# EAGLE schematic EM80RD (EAGLE 7.4.0)
DOC_NUM: DR20000110; REV: 10
Assembly variants: STD

## Sheet 1 of 5
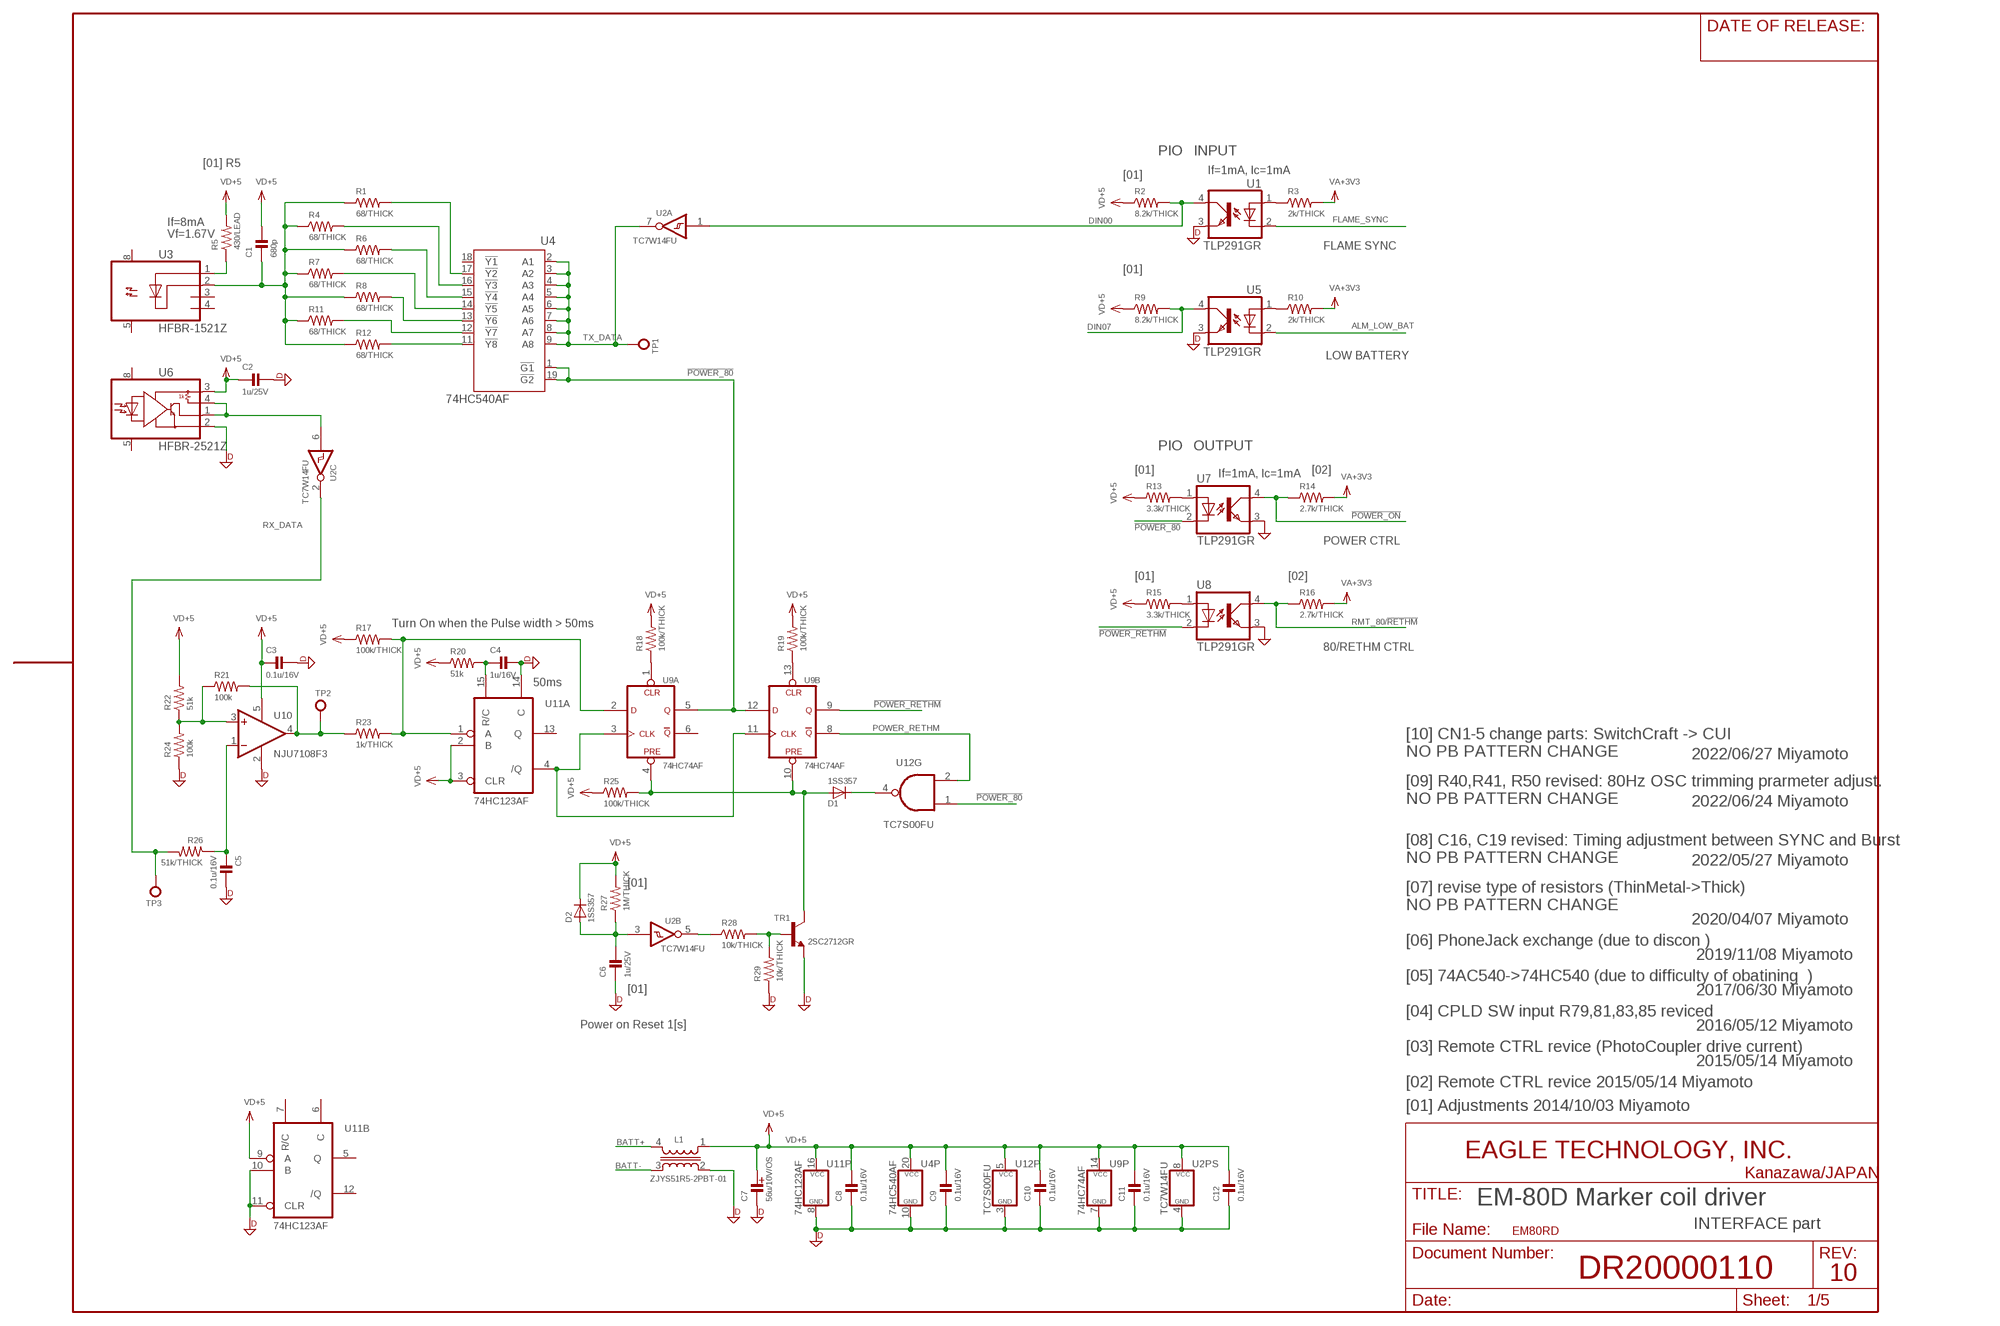
[diagram p0: schematic, sheet 1]

### Parts
C1  680p  CSMD1.6X0.8MM  [CM1608]
C2  1u/25V  CSMD2.0X1.2MM  [CM2012]
C3  0.1u/16V  CSMD1.6X0.8MM  [CM1608]
C4  1u/16V  CSMD2.0X1.2MM  [CM2012]
C5  0.1u/16V  CSMD1.6X0.8MM  [CM1608]
C6  1u/25V  CSMD1.6X0.8MM  [CM1608]
C7  56u/10V/OS  C_POL6.3-2.5MM  [PHI_6.3]
C8  0.1u/16V  CSMD1.6X0.8MM  [CM1608]
C9  0.1u/16V  CSMD1.6X0.8MM  [CM1608]
C10  0.1u/16V  CSMD1.6X0.8MM  [CM1608]
C11  0.1u/16V  CSMD1.6X0.8MM  [CM1608]
C12  0.1u/16V  CSMD1.6X0.8MM  [CM1608]
D1  1SS357  [SOD323-R]
D2  1SS357  [SOD323-R]
L1  ZJYS51R5-2PBT-01  ZJYS5R5-2PBT-01  [ZJYS51-2]
R1  68/THICK  RSMD1.6X0.8MM  [RM1608]
R2  8.2k/THICK  RSMD1.6X0.8MM  [RM1608]
R3  2k/THICK  RSMD1.6X0.8MM  [RM1608]
R4  68/THICK  RSMD1.6X0.8MM  [RM1608]
R5  430/LEAD  R0207/2V  [0207/2V]
R6  68/THICK  RSMD1.6X0.8MM  [RM1608]
R7  68/THICK  RSMD1.6X0.8MM  [RM1608]
R8  68/THICK  RSMD1.6X0.8MM  [RM1608]
R9  8.2k/THICK  RSMD1.6X0.8MM  [RM1608]
R10  2k/THICK  RSMD1.6X0.8MM  [RM1608]
R11  68/THICK  RSMD1.6X0.8MM  [RM1608]
R12  68/THICK  RSMD1.6X0.8MM  [RM1608]
R13  3.3k/THICK  RSMD1.6X0.8MM  [RM1608]
R14  2.7k/THICK  RSMD1.6X0.8MM  [RM1608]
R15  3.3k/THICK  RSMD1.6X0.8MM  [RM1608]
R16  2.7k/THICK  RSMD1.6X0.8MM  [RM1608]
R17  100k/THICK  RSMD1.6X0.8MM  [RM1608]
R18  100k/THICK  RSMD1.6X0.8MM  [RM1608]
R19  100k/THICK  RSMD1.6X0.8MM  [RM1608]
R20  51k  RSMD1.6X0.8MM  [RM1608]
R21  100k  RSMD1.6X0.8MM  [RM1608]
R22  51k  RSMD1.6X0.8MM  [RM1608]
R23  1k/THICK  RSMD1.6X0.8MM  [RM1608]
R24  100k  RSMD1.6X0.8MM  [RM1608]
R25  100k/THICK  RSMD1.6X0.8MM  [RM1608]
R26  51k/THICK  RSMD1.6X0.8MM  [RM1608]
R27  1M/THICK  RSMD1.6X0.8MM  [RM1608]
R28  10k/THICK  RSMD1.6X0.8MM  [RM1608]
R29  10k/THICK  RSMD1.6X0.8MM  [RM1608]
TP1  TP-LC3G  [TP_TH_0R9MM]
TP2  TP-LC3G  [TP_TH_0R9MM]
TP3  TP-LC3G  [TP_TH_0R9MM]
TR1  2SC2712GR  [SOT23-BEC]
U1  TLP291GR  [SO4(11-3C1)(TOSHIBA)]
U2  TC7W14FU  TC7WZ14FU  [SSOP8-P-065]
U3  HFBR-1521Z  [HFBR-X52X]
U4  74HC540AF  [SO20_300MIL]
U5  TLP291GR  [SO4(11-3C1)(TOSHIBA)]
U6  HFBR-2521Z  [HFBR-X52X]
U7  TLP291GR  [SO4(11-3C1)(TOSHIBA)]
U8  TLP291GR  [SO4(11-3C1)(TOSHIBA)]
U9  74HC74AF  [SO14_300MIL]
U10  NJU7108F3  [SC88A]
U11  74HC123AF  [SO16_300MIL]
U12  TC7S00FU  [SSOP5-P-065A(USV)]

### Nets
!POWER_80: U4.1(!G1) U4.19(!G2) U7.2(C) U9.5(A:Q) U9.12(B:D) U12.1(G:I1)
!POWER_ON: R14.1 U7.4(COL) ; also sheet 4
!POWER_RETHM: U8.2(C) U9.9(B:Q)
AGND: U7.3(EMI) U8.3(EMI) ; also sheet 2,3,4
ALM_LOW_BAT: U5.2(C) ; also sheet 4
BATT+: L1.4 ; also sheet 2
BATT-: L1.3 ; also sheet 2
DGND: C2.1 C3.1 C4.1 C5.1 C6.2 C7.NEG C8.2 C9.2 C10.2 C11.2 C12.2 L1.2 R24.1 R29.1 TR1.E U1.3(EMI) U2.4(PS:GND) U4.10(GND) U5.3(EMI) U6.2(GND) U9.7(P:GND) U10.2(V-) U11.8(P:GND) U11.10(B:B) U11.11(B:CLR) U11.14(A:C) U12.3(P:GND) ; also sheet 2,5
DIN00: R2.2 U1.4(COL) U2.1(A:I)
DIN07: R9.2 U5.4(COL)
FLAME_SYNC: U1.2(C) ; also sheet 4
N$1: R1.2 U4.17(!Y2)
N$2: R6.2 U4.15(!Y4)
N$3: R7.2 U4.14(!Y5)
N$4: R8.2 U4.13(!Y6)
N$5: R11.2 U4.12(!Y7)
N$6: R12.2 U4.11(!Y8)
N$7: R4.2 U4.16(!Y3)
N$9: R21.1 R22.1 R24.2 U10.3(+IN)
N$10: R21.2 R23.1 TP2.1(MP) U10.4(OUT)
N$12: C5.2 R26.1 U10.1(-IN)
N$14: D1.A R25.2 TR1.C U9.4(A:PRE) U9.10(B:PRE)
N$15: R19.1 U9.13(B:CLR)
N$16: C1.2 R1.1 R4.1 R6.1 R7.1 R8.1 R11.1 R12.1 U3.2(C)
N$18: R5.1 U3.1(A)
N$20: U2.6(C:I) U6.1(VO) U6.4(RL)
N$23: R3.1 U1.1(A)
N$24: R10.1 U5.1(A)
N$54: U9.3(A:CLK) U9.11(B:CLK) U11.4(A:/Q)
N$99: C6.1 D2.A R27.1 U2.3(B:I)
N$101: R13.2 U7.1(A)
N$104: R15.2 U8.1(A)
N$125: R18.1 U9.1(A:CLR)
N$126: C4.2 R20.2 U11.15(A:R/C)
N$128: D1.C U12.4(G:O)
N$129: R28.1 U2.5(B:O)
N$130: R28.2 R29.2 TR1.B
POWER_RETHM: U9.8(B:!Q) U12.2(G:I0)
PWR_ON: R17.2 R23.2 U9.2(A:D) U11.1(A:A)
RMT_80/!RETHM: R16.1 U8.4(COL) ; also sheet 4
RX_DATA: R26.2 TP3.1(MP) U2.2(C:O)
TX_DATA: TP1.1(MP) U2.7(A:O) U4.2(A1) U4.3(A2) U4.4(A3) U4.5(A4) U4.6(A5) U4.7(A6) U4.8(A7) U4.9(A8)
VA+3V3: R3.2 R10.2 R14.2 R16.2 ; also sheet 2,4
VD+5: C1.1 C2.2 C3.2 C7.POS C8.1 C9.1 C10.1 C11.1 C12.1 D2.C L1.1 R2.1 R5.2 R9.1 R13.1 R15.1 R17.1 R18.2 R19.2 R20.1 R22.2 R25.1 R27.2 U2.8(PS:VCC) U4.20(VCC) U6.3(VCC) U9.14(P:VCC) U10.5(V+) U11.2(A:B) U11.3(A:CLR) U11.9(B:A) U11.16(P:VCC) U12.5(P:VCC)
Unconnected: U3.3(NC1) U3.4(NC2) U3.5(TAB2) U3.8(TAB1) U4.18(!Y1) U6.5(TAB2) U6.8(TAB1) U9.6(A:!Q) U11.5(B:Q) U11.6(B:C) U11.7(B:R/C) U11.12(B:/Q) U11.13(A:Q)

### Notes on the sheet
- PIO | INPUT
- [01] R5
- If=1mA, Ic=1mA
- [01]
- If=8mA
- Vf=1.67V
- FLAME SYNC
- [01]
- LOW BATTERY
- PIO | OUTPUT
- [01] | [02]
- If=1mA, Ic=1mA
- POWER CTRL
- [01] | [02]
- Turn On when the Pulse width > 50ms
- 80/RETHM CTRL
- 50ms
- [10] CN1-5 change parts: SwitchCraft -> CUI 
  NO PB PATTERN CHANGE
- 2022/06/27 Miyamoto
- [09] R40,R41, R50 revised: 80Hz OSC trimming prarmeter adjust. 
  NO PB PATTERN CHANGE
- 2022/06/24 Miyamoto
- [08] C16, C19 revised: Timing adjustment between SYNC and Burst
  NO PB PATTERN CHANGE
- 2022/05/27 Miyamoto
- [01]
- [07] revise type of resistors (ThinMetal->Thick)
  NO PB PATTERN CHANGE
- 2020/04/07 Miyamoto
- [06] PhoneJack exchange (due to discon )
- 2019/11/08 Miyamoto
- [05] 74AC540->74HC540 (due to difficulty of obatining  )
- [01] | 2017/06/30 Miyamoto
- [04] CPLD SW input R79,81,83,85 reviced
- Power on Reset 1[s] | 2016/05/12 Miyamoto
- [03] Remote CTRL revice (PhotoCoupler drive current)
- 2015/05/14 Miyamoto
- [02] Remote CTRL revice 2015/05/14 Miyamoto
- [01] Adjustments 2014/10/03 Miyamoto
- EM-80D Marker coil driver
- INTERFACE part

## Sheet 2 of 5
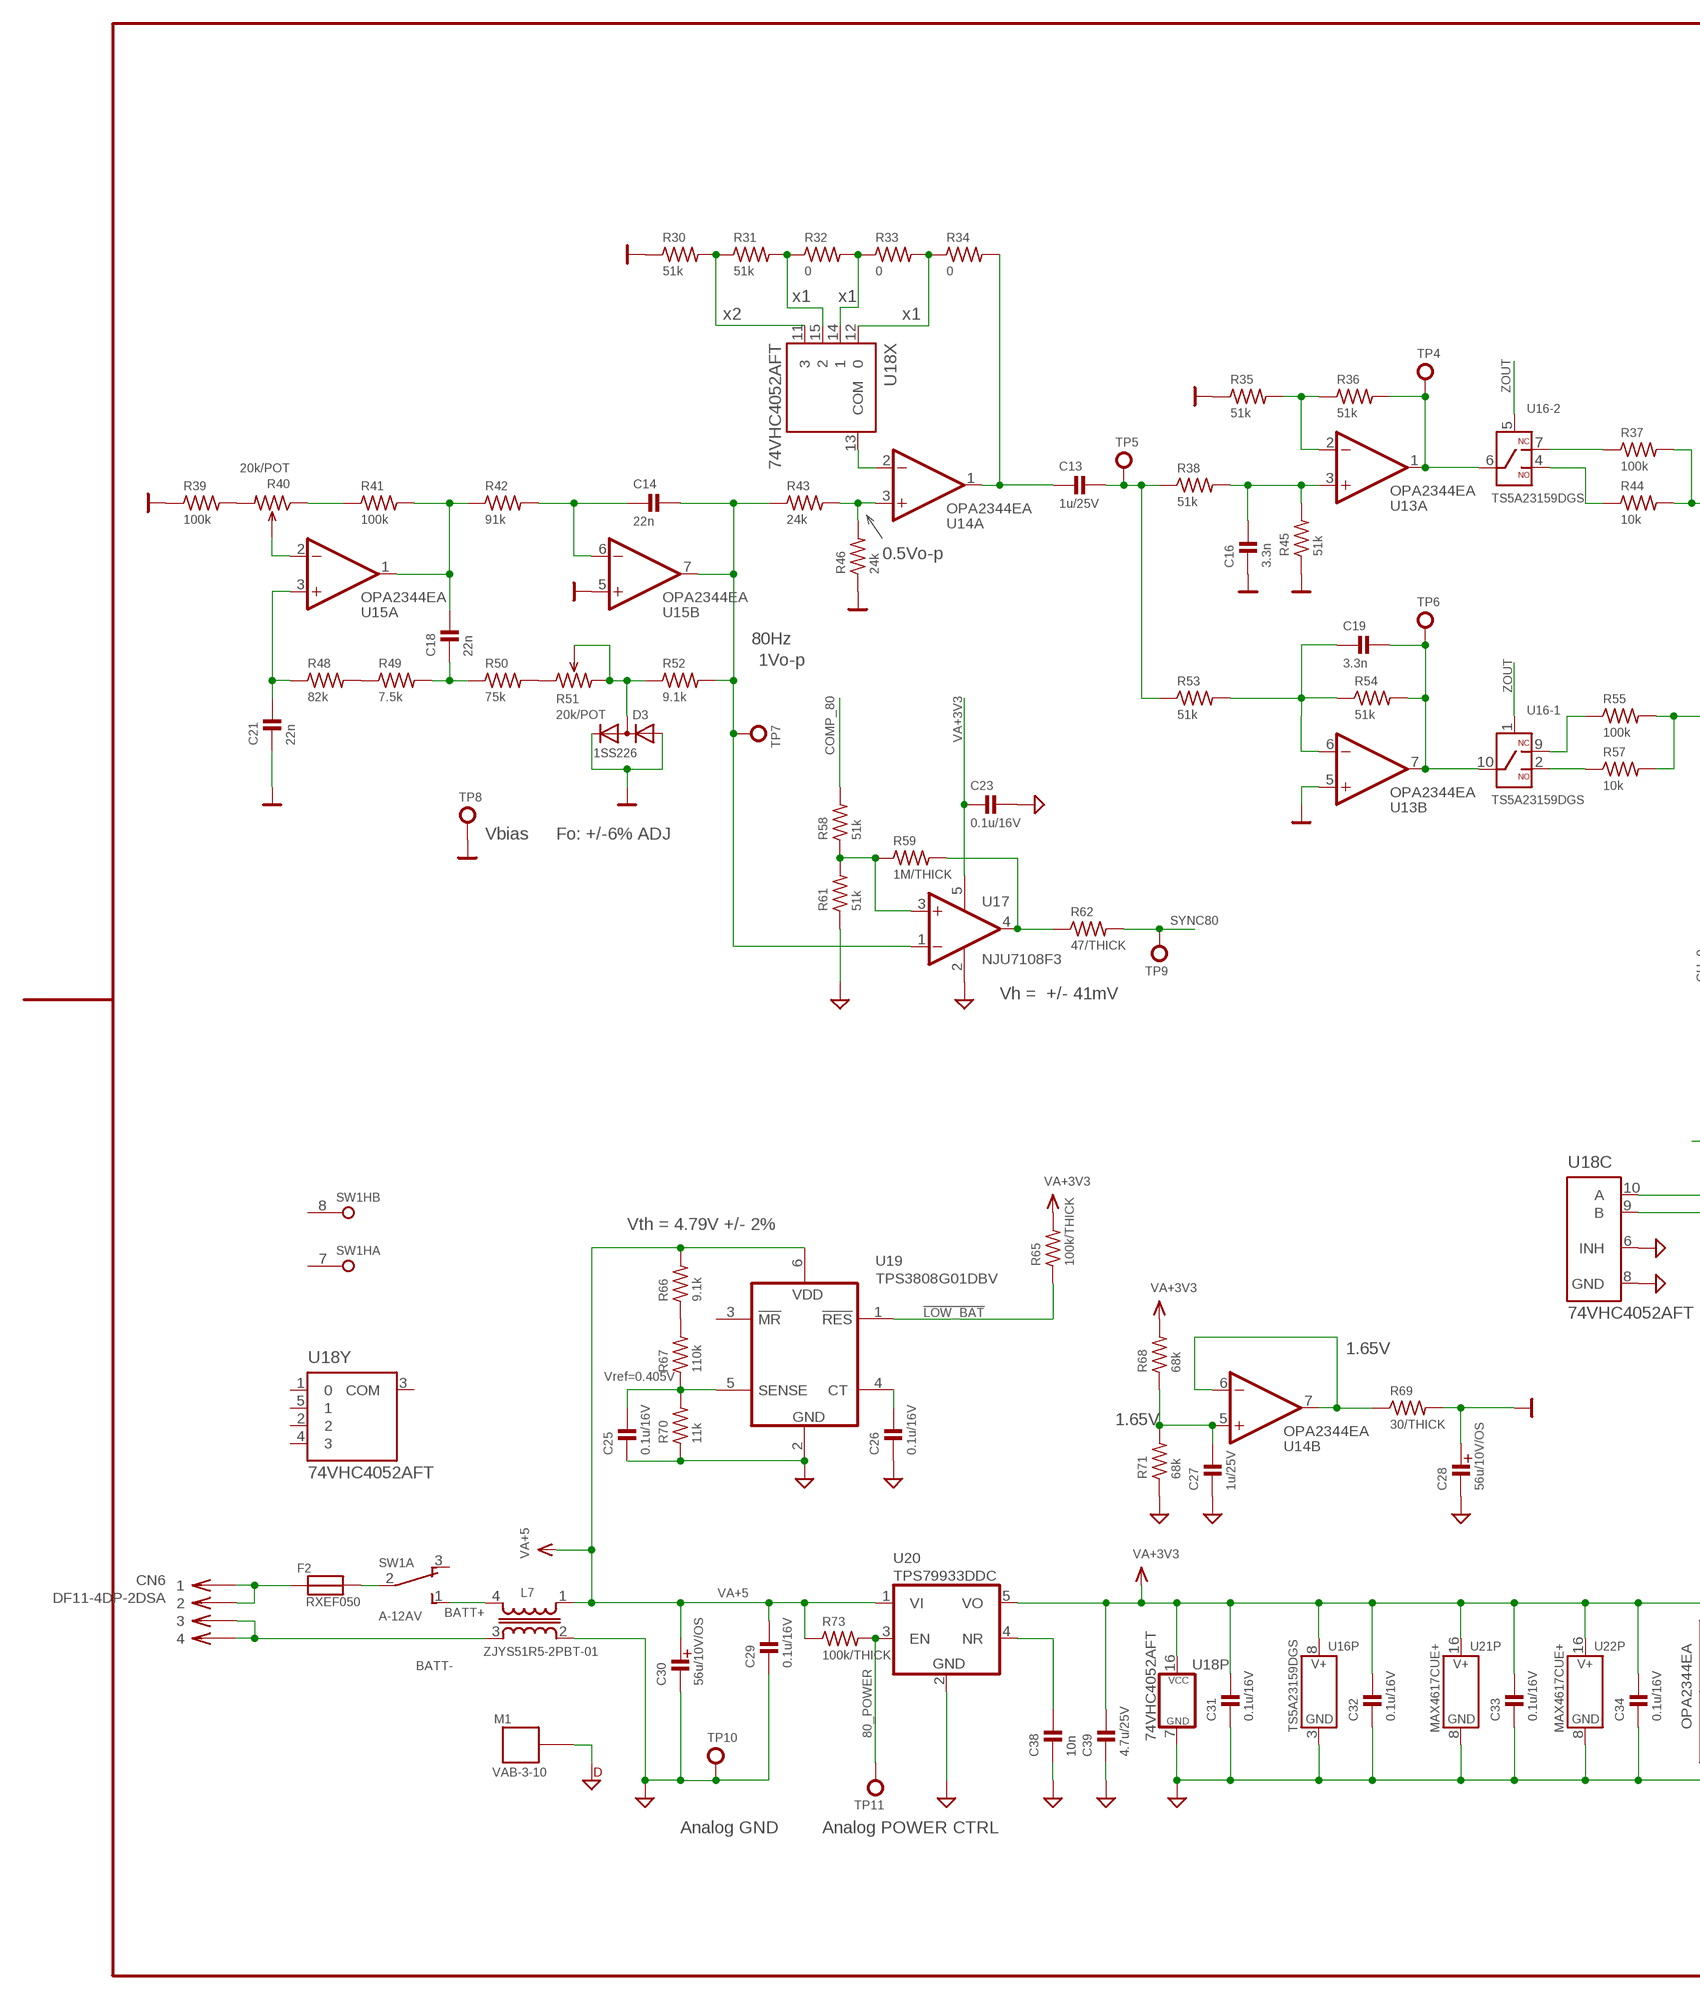
[diagram p1: schematic, sheet 2, part 1 of 2]
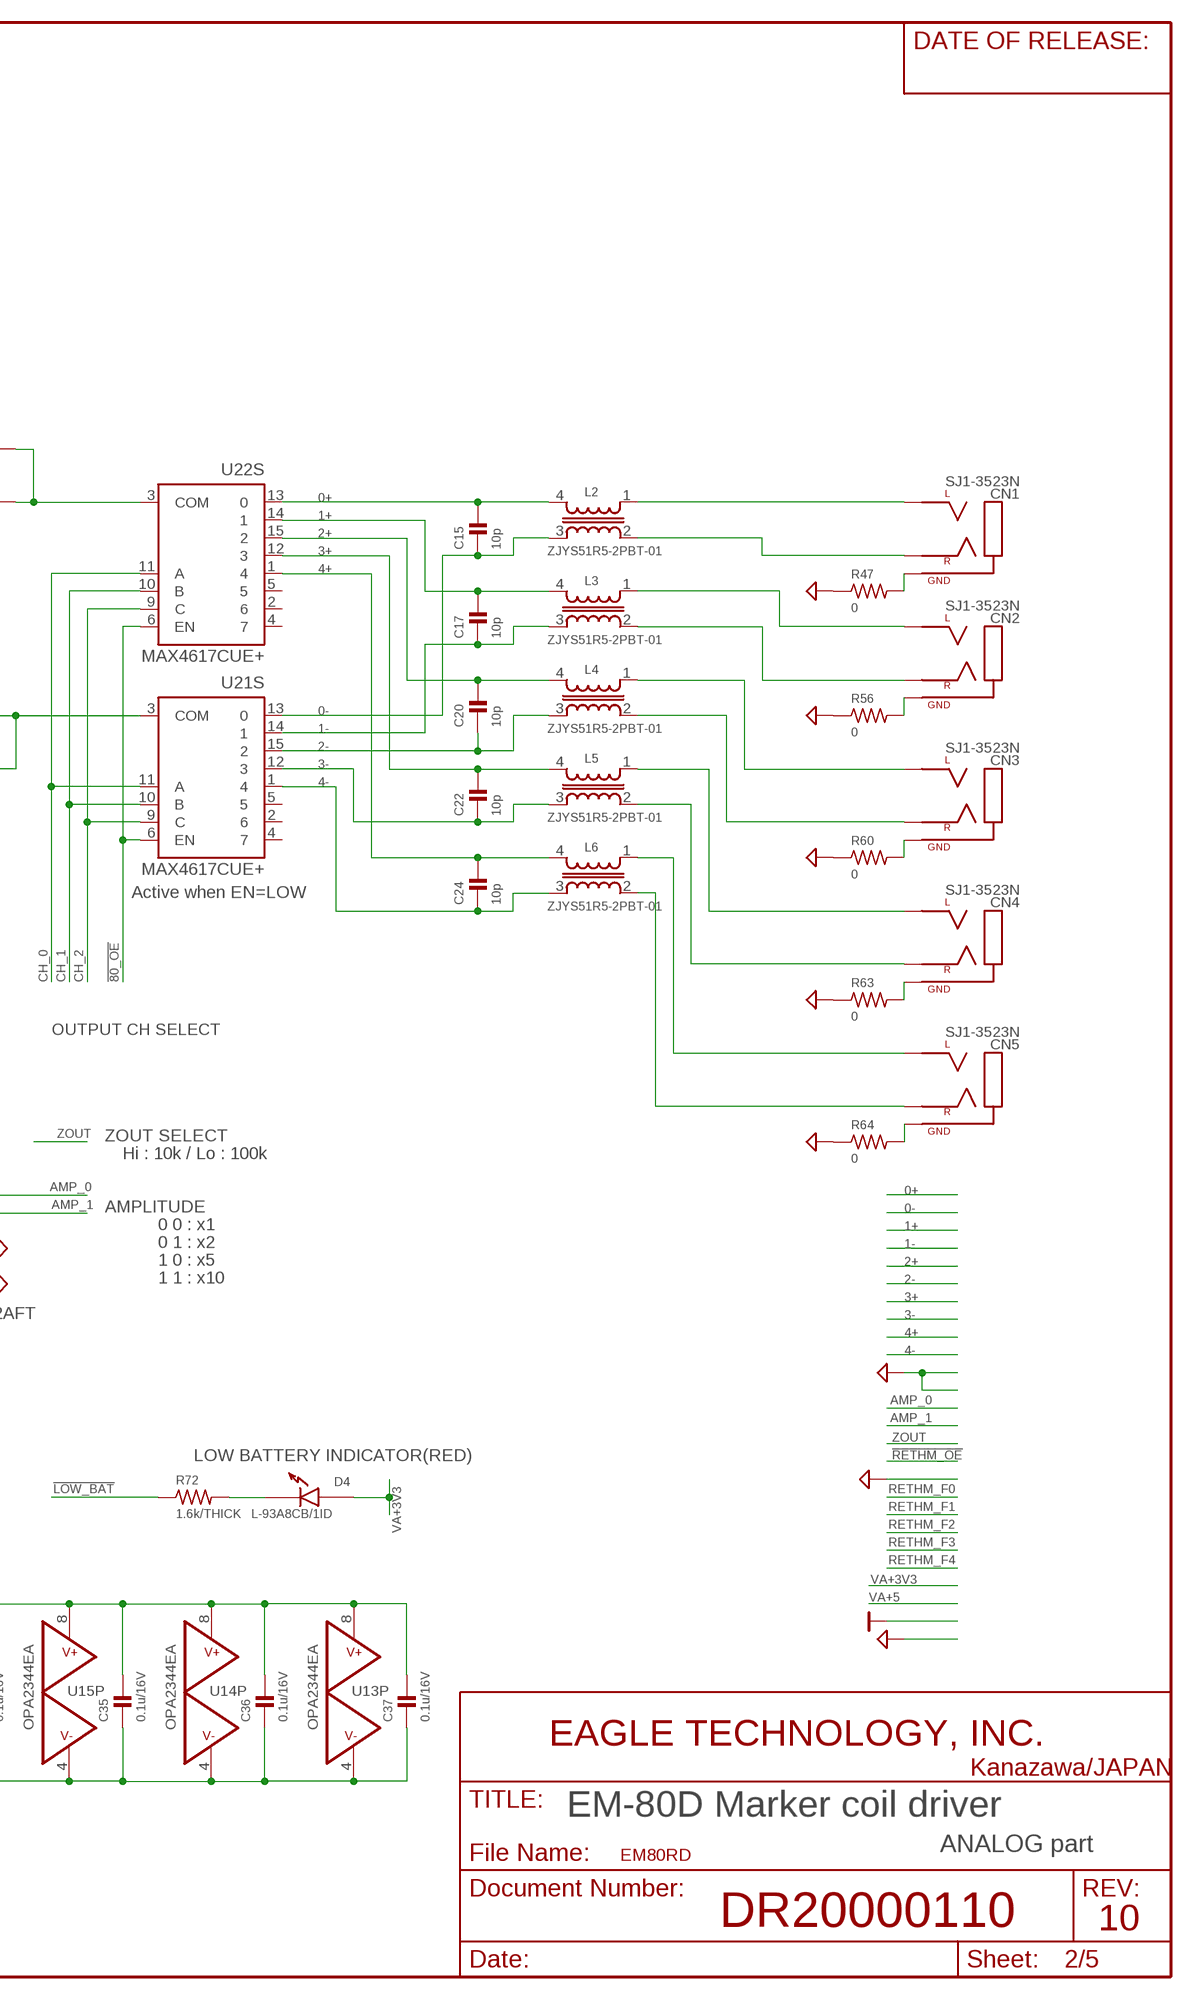
[diagram p2: schematic, sheet 2, part 2 of 2]

### Parts
C13  1u/25V  CSMD1.6X0.8MM  [CM1608]
C14  22n  CSMD3.2X1.6MM  [CM3216]
C15  10p  CSMD1.6X0.8MM  [CM1608]
C16  3.3n  CSMD2.0X1.2MM  [CM2012]
C17  10p  CSMD1.6X0.8MM  [CM1608]
C18  22n  CSMD3.2X1.6MM  [CM3216]
C19  3.3n  CSMD2.0X1.2MM  [CM2012]
C20  10p  CSMD1.6X0.8MM  [CM1608]
C21  22n  CSMD3.2X1.6MM  [CM3216]
C22  10p  CSMD1.6X0.8MM  [CM1608]
C23  0.1u/16V  CSMD1.6X0.8MM  [CM1608]
C24  10p  CSMD1.6X0.8MM  [CM1608]
C25  0.1u/16V  CSMD1.6X0.8MM  [CM1608]
C26  0.1u/16V  CSMD1.6X0.8MM  [CM1608]
C27  1u/25V  CSMD1.6X0.8MM  [CM1608]
C28  56u/10V/OS  C_POL6.3-2.5MM  [PHI_6.3]
C29  0.1u/16V  CSMD1.6X0.8MM  [CM1608]
C30  56u/10V/OS  C_POL6.3-2.5MM  [PHI_6.3]
C31  0.1u/16V  CSMD1.6X0.8MM  [CM1608]
C32  0.1u/16V  CSMD1.6X0.8MM  [CM1608]
C33  0.1u/16V  CSMD1.6X0.8MM  [CM1608]
C34  0.1u/16V  CSMD1.6X0.8MM  [CM1608]
C35  0.1u/16V  CSMD1.6X0.8MM  [CM1608]
C36  0.1u/16V  CSMD1.6X0.8MM  [CM1608]
C37  0.1u/16V  CSMD1.6X0.8MM  [CM1608]
C38  10n  CSMD2.0X1.2MM  [CM2012]
C39  4.7u/25V  CSMD2.0X1.2MM  [CM2012]
CN1  SJ1-3523N  35RAPC2BHN2  [35RAPC2BHN2]
CN2  SJ1-3523N  35RAPC2BHN2  [35RAPC2BHN2]
CN3  SJ1-3523N  35RAPC2BHN2  [35RAPC2BHN2]
CN4  SJ1-3523N  35RAPC2BHN2  [35RAPC2BHN2]
CN5  SJ1-3523N  35RAPC2BHN2  [35RAPC2BHN2]
CN6  DF11-4DP-2DSA  [DF11-4DP-2DSA]
D3  1SS226  [SOT23]
D4  L-93A8CB/1ID  [L-93A8CB]
F2  RXEF050  [8X3/5.08]
L2  ZJYS51R5-2PBT-01  ZJYS5R5-2PBT-01  [ZJYS51-2]
L3  ZJYS51R5-2PBT-01  ZJYS5R5-2PBT-01  [ZJYS51-2]
L4  ZJYS51R5-2PBT-01  ZJYS5R5-2PBT-01  [ZJYS51-2]
L5  ZJYS51R5-2PBT-01  ZJYS5R5-2PBT-01  [ZJYS51-2]
L6  ZJYS51R5-2PBT-01  ZJYS5R5-2PBT-01  [ZJYS51-2]
L7  ZJYS51R5-2PBT-01  ZJYS5R5-2PBT-01  [ZJYS51-2]
M1  VAB-3-10  [VAB_3_10_CONTACT]
R30  51k  RSMD1.6X0.8MM  [RM1608]
R31  51k  RSMD1.6X0.8MM  [RM1608]
R32  0  RSMD1.6X0.8MM  [RM1608]
R33  0  RSMD1.6X0.8MM  [RM1608]
R34  0  RSMD1.6X0.8MM  [RM1608]
R35  51k  RSMD1.6X0.8MM  [RM1608]
R36  51k  RSMD1.6X0.8MM  [RM1608]
R37  100k  RSMD1.6X0.8MM  [RM1608]
R38  51k  RSMD1.6X0.8MM  [RM1608]
R39  100k  RSMD1.6X0.8MM  [RM1608]
R40  20k/POT  R_POT  [CT-6]
R41  100k  RSMD1.6X0.8MM  [RM1608]
R42  91k  RSMD1.6X0.8MM  [RM1608]
R43  24k  RSMD1.6X0.8MM  [RM1608]
R44  10k  RSMD1.6X0.8MM  [RM1608]
R45  51k  RSMD1.6X0.8MM  [RM1608]
R46  24k  RSMD1.6X0.8MM  [RM1608]
R47  0  RSMD1.6X0.8MM  [RM1608]
R48  82k  RSMD1.6X0.8MM  [RM1608]
R49  7.5k  RSMD1.6X0.8MM  [RM1608]
R50  75k  RSMD1.6X0.8MM  [RM1608]
R51  20k/POT  R_POT  [CT-6]
R52  9.1k  RSMD1.6X0.8MM  [RM1608]
R53  51k  RSMD1.6X0.8MM  [RM1608]
R54  51k  RSMD1.6X0.8MM  [RM1608]
R55  100k  RSMD1.6X0.8MM  [RM1608]
R56  0  RSMD1.6X0.8MM  [RM1608]
R57  10k  RSMD1.6X0.8MM  [RM1608]
R58  51k  RSMD1.6X0.8MM  [RM1608]
R59  1M/THICK  RSMD1.6X0.8MM  [RM1608]
R60  0  RSMD1.6X0.8MM  [RM1608]
R61  51k  RSMD1.6X0.8MM  [RM1608]
R62  47/THICK  RSMD1.6X0.8MM  [RM1608]
R63  0  RSMD1.6X0.8MM  [RM1608]
R64  0  RSMD1.6X0.8MM  [RM1608]
R65  100k/THICK  RSMD1.6X0.8MM  [RM1608]
R66  9.1k  RSMD1.6X0.8MM  [RM1608]
R67  110k  RSMD1.6X0.8MM  [RM1608]
R68  68k  RSMD1.6X0.8MM  [RM1608]
R69  30/THICK  RSMD1.6X0.8MM  [RM1608]
R70  11k  RSMD1.6X0.8MM  [RM1608]
R71  68k  RSMD1.6X0.8MM  [RM1608]
R72  1.6k/THICK  RSMD1.6X0.8MM  [RM1608]
R73  100k/THICK  RSMD1.6X0.8MM  [RM1608]
SW1  A-12AV  [A-12*]
TP4  TP-LC3G  [TP_TH_0R9MM]
TP5  TP-LC3G  [TP_TH_0R9MM]
TP6  TP-LC3G  [TP_TH_0R9MM]
TP7  TP-LC3G  [TP_TH_0R9MM]
TP8  TP-LC3G  [TP_TH_0R9MM]
TP9  TP-LC3G  [TP_TH_0R9MM]
TP10  TP-LC3G  [TP_TH_0R9MM]
TP11  TP-LC3G  [TP_TH_0R9MM]
U13  OPA2344EA  [MSO8_AEL]
U14  OPA2344EA  [MSO8_AEL]
U15  OPA2344EA  [MSO8_AEL]
U16  TS5A23159DGS  [MSOP10]
U17  NJU7108F3  [SC88A]
U18  74VHC4052AFT  [TSSOP16-P-044-065A]
U19  TPS3808G01DBV  [SOT-23]
U20  TPS79933DDC  [SOT-23-5]
U21  MAX4617CUE+  [TSSOP16_AEL]
U22  MAX4617CUE+  [TSSOP16_AEL]

### Nets
0+: C15.1 L2.4 U22.13 ; also sheet 3
0-: C15.2 L2.3 U21.13 ; also sheet 3
0V: C16.2 C21.2 C28.POS D3.1(A) D3.2(C) R30.1 R35.1 R39.1 R45.1 R46.1 R69.2 TP8.1(MP) U13.5(B:+IN) U15.5(B:+IN)
1+: C17.1 L3.4 U22.14 ; also sheet 3
1-: C17.2 L3.3 U21.14 ; also sheet 3
2+: C20.1 L4.4 U22.15 ; also sheet 3
2-: C20.2 L4.3 U21.15 ; also sheet 3
3+: C22.1 L5.4 U22.12 ; also sheet 3
3-: C22.2 L5.3 U21.12 ; also sheet 3
4+: C24.1 L6.4 U22.1 ; also sheet 3
4-: C24.2 L6.3 U21.1 ; also sheet 3
80_POWER: R73.2 TP11.1(MP) U20.3(EN)
!80_OE: U21.6(S:EN) U22.6(S:EN) ; also sheet 4
!LOW_BAT: R65.1 R72.1 U19.1(!RESET) ; also sheet 4
AGND: C23.1 C25.2 C26.2 C27.2 C28.NEG C29.2 C30.NEG C31.2 C32.2 C33.2 C34.2 C35.2 C36.2 C37.2 C38.2 C39.2 L7.2 R47.1 R56.1 R60.1 R61.1 R63.1 R64.1 R70.1 R71.1 TP10.1(MP) U13.4(P:V-) U14.4(P:V-) U15.4(P:V-) U16.3(P:V-) U17.2(V-) U18.6(C:INH) U18.7(P:GND) U18.8(C:GND) U19.2(GND) U20.2(GND) U21.8(P:V-) U22.8(P:V-) ; also sheet 1,3,4
AMP_0: U18.10(C:A) ; also sheet 3,4
AMP_1: U18.9(C:B) ; also sheet 3,4
BATT+: L7.4 SW1.1(A:NO) ; also sheet 1
BATT-: CN6.3 CN6.4 L7.3 ; also sheet 1
CH_0: U21.11(S:A) U22.11(S:A) ; also sheet 4
CH_1: U21.10(S:B) U22.10(S:B) ; also sheet 4
CH_2: U21.9(S:C) U22.9(S:C) ; also sheet 4
COMP_80: R58.2 ; also sheet 4
DGND: M1.CASE1 ; also sheet 1,5
N$11: R50.2 R51.1
N$13: R39.2 R40.3
N$17: CN5.1(GND) R64.2
N$19: R30.2 R31.1 U18.11
N$21: R31.2 R32.1 U18.15
N$22: R32.2 R33.1 U18.14
N$25: R33.2 R34.1 U18.12
N$26: C27.1 R68.1 R71.2 U14.5(B:+IN)
N$27: C19.2 R53.2 R54.1 U13.6(B:-IN)
N$28: U14.2(A:-IN) U18.13(X:COM)
N$29: C13.2 R34.2 U14.1(A:OUT)
N$30: R43.2 R46.2 U14.3(A:+IN)
N$31: C19.1 R54.2 TP6.1(MP) U13.7(B:OUT) U16.10(-1:COM)
N$32: R36.2 TP4.1(MP) U13.1(A:OUT) U16.6(-2:COM)
N$33: R35.2 R36.1 U13.2(A:-IN)
N$34: C16.1 R38.2 R45.2 U13.3(A:+IN)
N$35: R57.1 U16.2(-1:NO)
N$36: R55.1 U16.9(-1:NC)
N$37: R55.2 R57.2 U21.3(S:COM)
N$38: R37.1 U16.7(-2:NC)
N$39: R44.1 U16.4(-2:NO)
N$40: R37.2 R44.2 U22.3(S:COM)
N$41: R40.1 R41.1
N$42: C18.1 R41.2 R42.1 U15.1(A:OUT)
N$43: C14.2 R42.2 U15.6(B:-IN)
N$44: C14.1 R43.1 R52.2 TP7.1(MP) U15.7(B:OUT) U17.1(-IN)
N$45: R40.2 U15.2(A:-IN)
N$46: C21.1 R48.1 U15.3(A:+IN)
N$47: R48.2 R49.1
N$48: C18.2 R49.2 R50.1
N$49: D3.3(AC) R51.2 R51.3 R52.1
N$51: C13.1 R38.1 R53.1 TP5.1(MP)
N$52: R69.1 U14.6(B:-IN) U14.7(B:OUT)
N$57: R58.1 R59.1 R61.2 U17.3(+IN)
N$58: R59.2 R62.1 U17.4(OUT)
N$59: D4.C(K1) R72.2
N$60: C26.1 U19.4(CT)
N$62: C25.1 R67.1 R70.2 U19.5(SENSE)
N$64: C38.1 U20.4(NR)
N$74: CN6.1 CN6.2 F2.1
N$76: R66.1 R67.2
N$82: CN1.2(L) L2.1
N$83: CN1.3(R) L2.2
N$84: CN2.2(L) L3.1
N$85: CN2.3(R) L3.2
N$86: CN3.2(L) L4.1
N$87: CN3.3(R) L4.2
N$88: CN4.2(L) L5.1
N$89: CN4.3(R) L5.2
N$90: CN5.2(L) L6.1
N$91: CN5.3(R) L6.2
N$93: CN4.1(GND) R63.2
N$131: CN3.1(GND) R60.2
N$132: CN2.1(GND) R56.2
N$133: CN1.1(GND) R47.2
N$499: F2.2 SW1.2(A:C)
SYNC80: R62.2 TP9.1(MP) ; also sheet 4
VA+3V3: C23.2 C31.1 C32.1 C33.1 C34.1 C35.1 C36.1 C37.1 C39.1 D4.A(A1) R65.2 R68.2 U13.8(P:V+) U14.8(P:V+) U15.8(P:V+) U16.8(P:V+) U17.5(V+) U18.16(P:VCC) U20.5(VO) U21.16(P:V+) U22.16(P:V+) ; also sheet 1,4
VA+5: C29.1 C30.POS L7.1 R66.2 R73.1 U19.6(VDD) U20.1(VI) ; also sheet 3
ZOUT: U16.1(-1:IN) U16.5(-2:IN) ; also sheet 3,4
Unconnected: SW1.3(A:NC) SW1.7(HA:BRACKET) SW1.8(HB:BRACKET) U18.1 U18.2 U18.3(Y:COM) U18.4 U18.5 U19.3(!MR) U21.2 U21.4 U21.5 U22.2 U22.4 U22.5

### Notes on the sheet
- x1 | x1
- x2 | x1
- 0.5Vo-p
- 80Hz
- 1Vo-p
- Vbias | Fo: +/-6% ADJ
- Active when EN=LOW
- Vh =  +/- 41mV
- OUTPUT CH SELECT
- ZOUT SELECT
- Hi : 10k / Lo : 100k
- AMPLITUDE
- Vth = 4.79V +/- 2% | 0 0 : x1
- 0 1 : x2
- 1 0 : x5
- 1 1 : x10
- 1.65V
- Vref=0.405V
- 1.65V
- LOW BATTERY INDICATOR(RED)
- EM-80D Marker coil driver
- Analog GND | Analog POWER CTRL
- ANALOG part

## Sheet 3 of 5
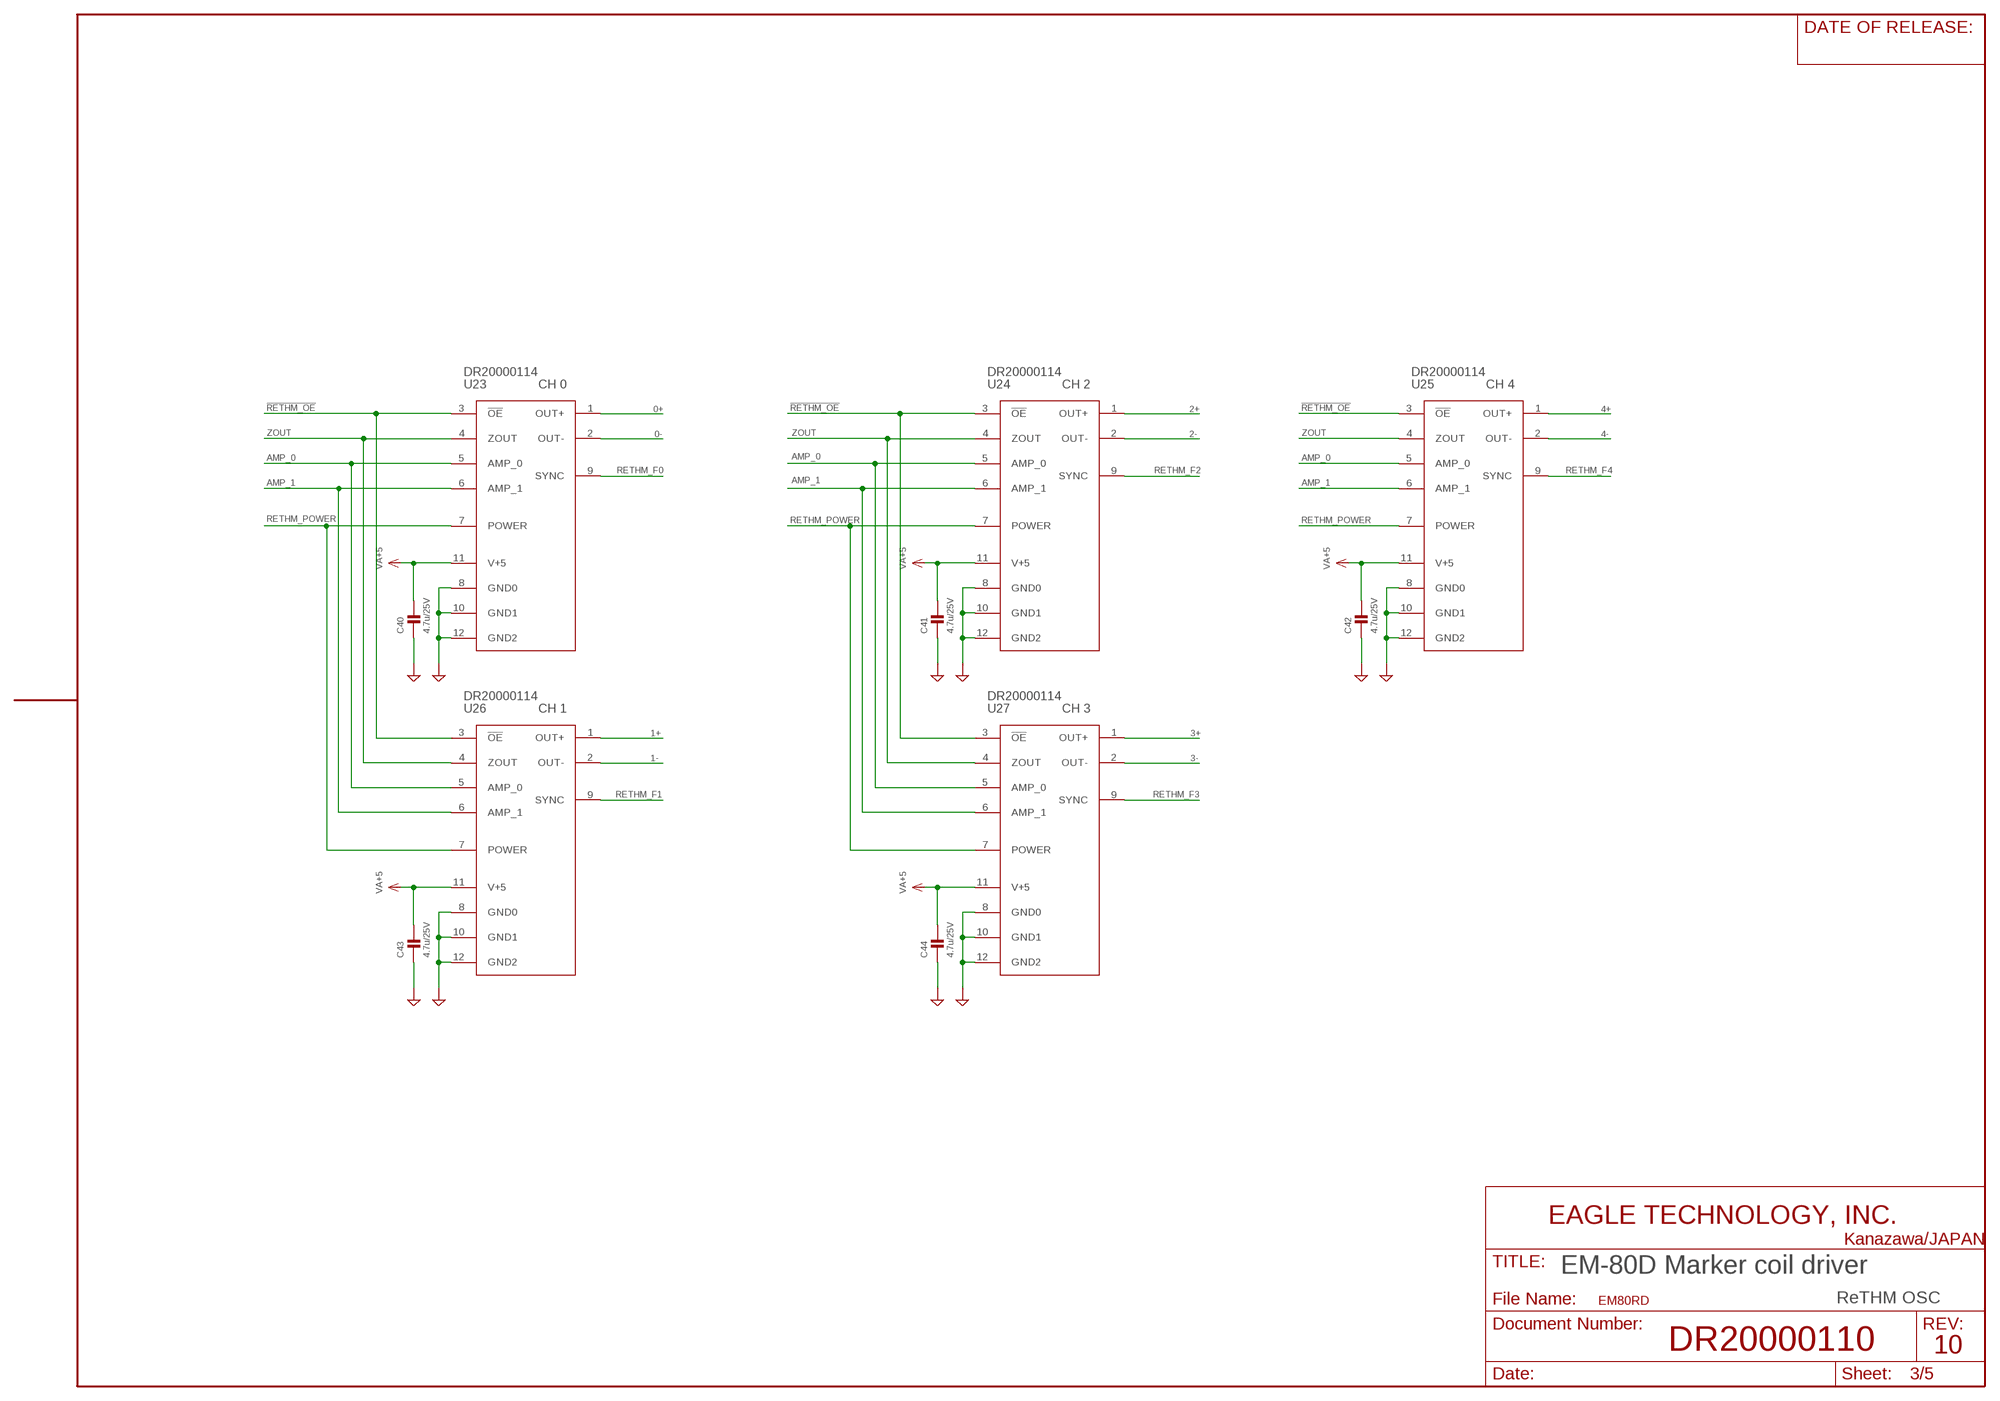
[diagram p3: schematic, sheet 3]

### Parts
C40  4.7u/25V  CSMD2.0X1.2MM  [CM2012]
C41  4.7u/25V  CSMD2.0X1.2MM  [CM2012]
C42  4.7u/25V  CSMD2.0X1.2MM  [CM2012]
C43  4.7u/25V  CSMD2.0X1.2MM  [CM2012]
C44  4.7u/25V  CSMD2.0X1.2MM  [CM2012]
U23  DR20000114  [DR20000114]
U24  DR20000114  [DR20000114]
U25  DR20000114  [DR20000114]
U26  DR20000114  [DR20000114]
U27  DR20000114  [DR20000114]

### Nets
0+: U23.1(OUT+) ; also sheet 2
0-: U23.2(OUT-) ; also sheet 2
1+: U26.1(OUT+) ; also sheet 2
1-: U26.2(OUT-) ; also sheet 2
2+: U24.1(OUT+) ; also sheet 2
2-: U24.2(OUT-) ; also sheet 2
3+: U27.1(OUT+) ; also sheet 2
3-: U27.2(OUT-) ; also sheet 2
4+: U25.1(OUT+) ; also sheet 2
4-: U25.2(OUT-) ; also sheet 2
!RETHM_OE: U23.3(!OE) U24.3(!OE) U25.3(!OE) U26.3(!OE) U27.3(!OE) ; also sheet 2,4
AGND: C40.2 C41.2 C42.2 C43.2 C44.2 U23.8(GND0) U23.10(GND1) U23.12(GND2) U24.8(GND0) U24.10(GND1) U24.12(GND2) U25.8(GND0) U25.10(GND1) U25.12(GND2) U26.8(GND0) U26.10(GND1) U26.12(GND2) U27.8(GND0) U27.10(GND1) U27.12(GND2) ; also sheet 1,2,4
AMP_0: U23.5(AMP_0) U24.5(AMP_0) U25.5(AMP_0) U26.5(AMP_0) U27.5(AMP_0) ; also sheet 2,4
AMP_1: U23.6(AMP_1) U24.6(AMP_1) U25.6(AMP_1) U26.6(AMP_1) U27.6(AMP_1) ; also sheet 2,4
RETHM_F0: U23.9(SYNC) ; also sheet 2,4
RETHM_F1: U26.9(SYNC) ; also sheet 2,4
RETHM_F2: U24.9(SYNC) ; also sheet 2,4
RETHM_F3: U27.9(SYNC) ; also sheet 2,4
RETHM_F4: U25.9(SYNC) ; also sheet 2,4
RETHM_POWER: U23.7(POWER) U24.7(POWER) U25.7(POWER) U26.7(POWER) U27.7(POWER) ; also sheet 4
VA+5: C40.1 C41.1 C42.1 C43.1 C44.1 U23.11(V+5) U24.11(V+5) U25.11(V+5) U26.11(V+5) U27.11(V+5) ; also sheet 2
ZOUT: U23.4(ZOUT) U24.4(ZOUT) U25.4(ZOUT) U26.4(ZOUT) U27.4(ZOUT) ; also sheet 2,4

### Notes on the sheet
- CH 0 | CH 2 | CH 4
- CH 1 | CH 3
- EM-80D Marker coil driver
- ReTHM OSC

## Sheet 4 of 5
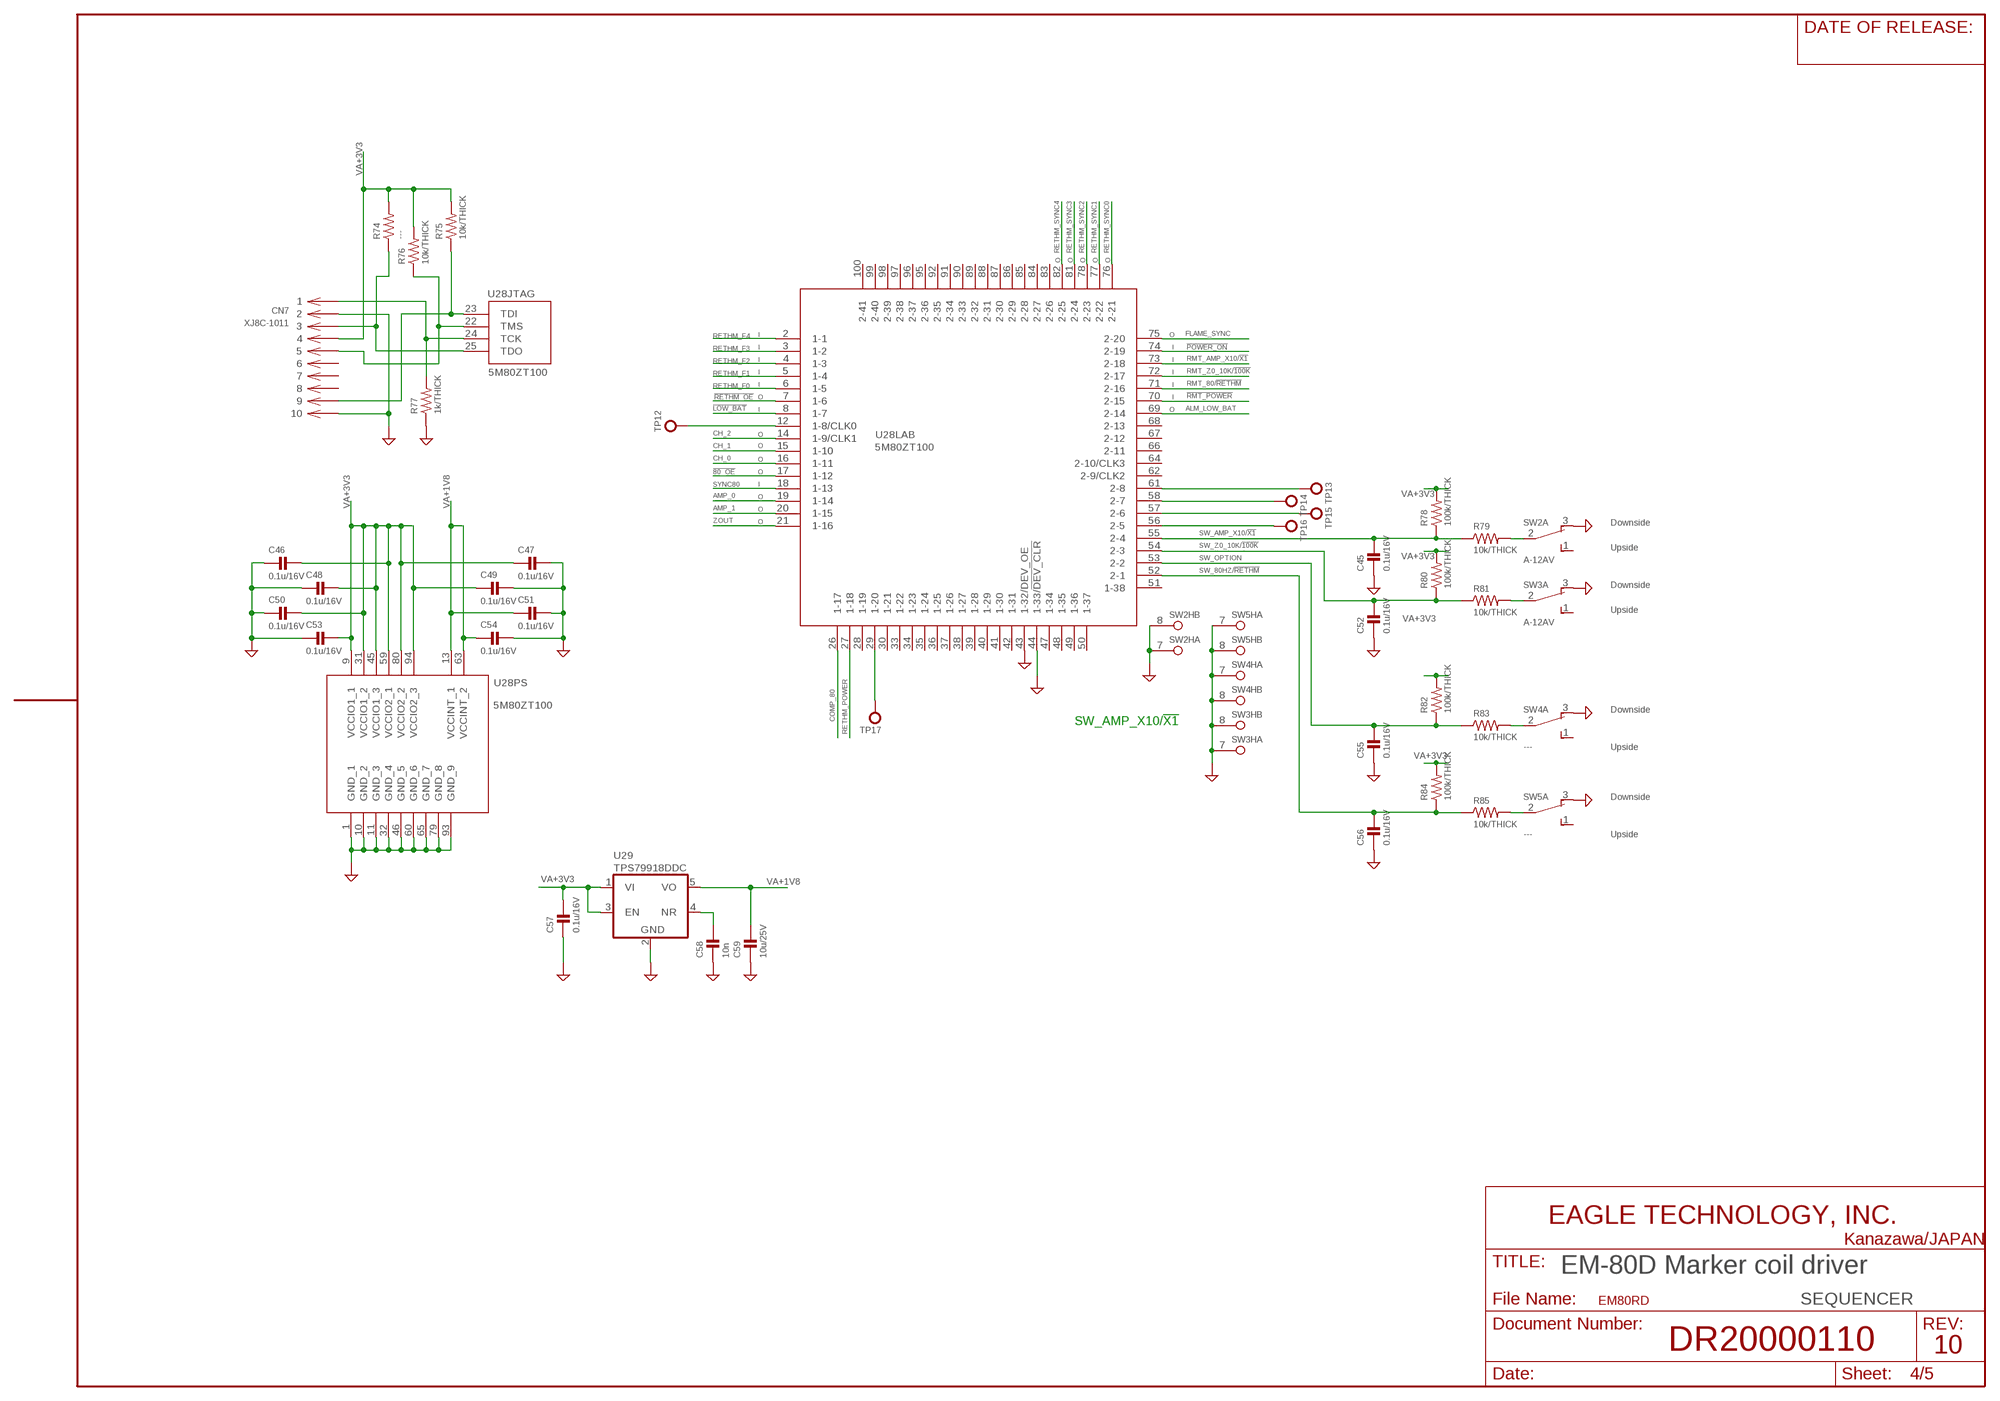
[diagram p4: schematic, sheet 4]

### Parts
C45  0.1u/16V  CSMD1.6X0.8MM  [CM1608]
C46  0.1u/16V  CSMD1.6X0.8MM  [CM1608]
C47  0.1u/16V  CSMD1.6X0.8MM  [CM1608]
C48  0.1u/16V  CSMD1.6X0.8MM  [CM1608]
C49  0.1u/16V  CSMD1.6X0.8MM  [CM1608]
C50  0.1u/16V  CSMD1.6X0.8MM  [CM1608]
C51  0.1u/16V  CSMD1.6X0.8MM  [CM1608]
C52  0.1u/16V  CSMD1.6X0.8MM  [CM1608]
C53  0.1u/16V  CSMD1.6X0.8MM  [CM1608]
C54  0.1u/16V  CSMD1.6X0.8MM  [CM1608]
C55  0.1u/16V  CSMD1.6X0.8MM  [CM1608]  (not fitted in variant STD)
C56  0.1u/16V  CSMD1.6X0.8MM  [CM1608]  (not fitted in variant STD)
C57  0.1u/16V  CSMD1.6X0.8MM  [CM1608]
C58  10n  CSMD2.0X1.2MM  [CM2012]
C59  10u/25V  CSMD3.2X1.6MM  [CM3216]
CN7  XJ8C-1011  PIN_HEADER_10PIN  [PIN_HEADER_10PIN]
R74  ---  RSMD1.6X0.8MM  [RM1608]
R75  10k/THICK  RSMD1.6X0.8MM  [RM1608]
R76  10k/THICK  RSMD1.6X0.8MM  [RM1608]
R77  1k/THICK  RSMD1.6X0.8MM  [RM1608]
R78  100k/THICK  RSMD1.6X0.8MM  [RM1608]
R79  10k/THICK  RSMD1.6X0.8MM  [RM1608]
R80  100k/THICK  RSMD1.6X0.8MM  [RM1608]
R81  10k/THICK  RSMD1.6X0.8MM  [RM1608]
R82  100k/THICK  RSMD1.6X0.8MM  [RM1608]  (not fitted in variant STD)
R83  10k/THICK  RSMD1.6X0.8MM  [RM1608]  (not fitted in variant STD)
R84  100k/THICK  RSMD1.6X0.8MM  [RM1608]  (not fitted in variant STD)
R85  10k/THICK  RSMD1.6X0.8MM  [RM1608]  (not fitted in variant STD)
SW2  A-12AV  [A-12*]
SW3  A-12AV  [A-12*]
SW4  ---  A-12AV  [A-12*]  (not fitted in variant STD)
SW5  ---  A-12AV  [A-12*]  (not fitted in variant STD)
TP12  TP-1PAD  [TP_PAD_1MM]
TP13  TP-1PAD  [TP_PAD_1MM]
TP14  TP-1PAD  [TP_PAD_1MM]
TP15  TP-1PAD  [TP_PAD_1MM]
TP16  TP-1PAD  [TP_PAD_1MM]
TP17  TP-1PAD  [TP_PAD_1MM]
U28  5M80ZT100  5M160ZT100  [QFP100_0.5]
U29  TPS79918DDC  [SOT-23-5]

### Nets
!80_OE: U28.17(LAB:1-12) ; also sheet 2
!LOW_BAT: U28.8(LAB:1-7) ; also sheet 2
!POWER_ON: U28.74(LAB:2-19) ; also sheet 1
!RETHM_OE: U28.7(LAB:1-6) ; also sheet 2,3
!RMT_POWER: U28.70(LAB:2-15)
AGND: C45.2 C46.2 C47.1 C48.2 C49.1 C50.2 C51.1 C52.2 C53.2 C54.1 C55.2 C56.2 C57.2 C58.2 C59.2 CN7.2 CN7.10 R77.1 SW2.3(A:NC) SW2.7(HA:BRACKET) SW2.8(HB:BRACKET) SW3.3(A:NC) SW3.7(HA:BRACKET) SW3.8(HB:BRACKET) SW4.3(A:NC) SW4.7(HA:BRACKET) SW4.8(HB:BRACKET) SW5.3(A:NC) SW5.7(HA:BRACKET) SW5.8(HB:BRACKET) U28.1(PS:GND_1) U28.10(PS:GND_2) U28.11(PS:GND_3) U28.32(PS:GND_4) U28.43(LAB:1-32/DEV_OE) U28.44(LAB:1-33/!DEV_CLR) U28.46(PS:GND_5) U28.60(PS:GND_6) U28.65(PS:GND_7) U28.79(PS:GND_8) U28.93(PS:GND_9) U29.2(GND) ; also sheet 1,2,3
ALM_LOW_BAT: U28.69(LAB:2-14) ; also sheet 1
AMP_0: U28.19(LAB:1-14) ; also sheet 2,3
AMP_1: U28.20(LAB:1-15) ; also sheet 2,3
CH_0: U28.16(LAB:1-11) ; also sheet 2
CH_1: U28.15(LAB:1-10) ; also sheet 2
CH_2: U28.14(LAB:1-9/CLK1) ; also sheet 2
COMP_80: U28.26(LAB:1-17) ; also sheet 2
FLAME_SYNC: U28.75(LAB:2-20) ; also sheet 1
N$50: CN7.9 R75.1 U28.23(JTAG:TDI)
N$53: TP12.P$1(MP) U28.12(LAB:1-8/CLK0)
N$56: CN7.1 R77.2 U28.24(JTAG:TCK)
N$71: CN7.3 R74.1 U28.25(JTAG:TDO)
N$72: CN7.5 R76.1 U28.22(JTAG:TMS)
N$75: C58.1 U29.4(NR)
N$78: TP16.P$1(MP) U28.56(LAB:2-5)
N$79: TP15.P$1(MP) U28.57(LAB:2-6)
N$80: TP14.P$1(MP) U28.58(LAB:2-7)
N$81: TP13.P$1(MP) U28.61(LAB:2-8)
N$96: TP17.P$1(MP) U28.29(LAB:1-20)
N$495: R85.2 SW5.2(A:C)
N$496: R83.2 SW4.2(A:C)
N$497: R81.2 SW3.2(A:C)
N$498: R79.2 SW2.2(A:C)
RETHM_F0: U28.6(LAB:1-5) ; also sheet 2,3
RETHM_F1: U28.5(LAB:1-4) ; also sheet 2,3
RETHM_F2: U28.4(LAB:1-3) ; also sheet 2,3
RETHM_F3: U28.3(LAB:1-2) ; also sheet 2,3
RETHM_F4: U28.2(LAB:1-1) ; also sheet 2,3
RETHM_POWER: U28.27(LAB:1-18) ; also sheet 3
RETHM_SYNC0: U28.76(LAB:2-21)
RETHM_SYNC1: U28.77(LAB:2-22)
RETHM_SYNC2: U28.78(LAB:2-23)
RETHM_SYNC3: U28.81(LAB:2-24)
RETHM_SYNC4: U28.82(LAB:2-25)
RMT_80/!RETHM: U28.71(LAB:2-16) ; also sheet 1
RMT_AMP_X10/!X1: U28.73(LAB:2-18)
RMT_Z0_10K/!100K: U28.72(LAB:2-17)
SW_80HZ/!RETHM: C56.1 R84.1 R85.1 U28.52(LAB:2-1)
SW_AMP_X10/!X1: C45.1 R78.1 R79.1 U28.55(LAB:2-4)
SW_OPTION: C55.1 R82.1 R83.1 U28.53(LAB:2-2)
SW_Z0_10K/!100K: C52.1 R80.1 R81.1 U28.54(LAB:2-3)
SYNC80: U28.18(LAB:1-13) ; also sheet 2
VA+1V8: C51.2 C54.2 C59.1 U28.13(PS:VCCINT_1) U28.63(PS:VCCINT_2) U29.5(VO)
VA+3V3: C46.1 C47.2 C48.1 C49.2 C50.1 C53.1 C57.1 CN7.4 R74.2 R75.2 R76.2 R78.2 R80.2 R82.2 R84.2 U28.9(PS:VCCIO1_1) U28.31(PS:VCCIO1_2) U28.45(PS:VCCIO1_3) U28.59(PS:VCCIO2_1) U28.80(PS:VCCIO2_2) U28.94(PS:VCCIO2_3) U29.1(VI) U29.3(EN) ; also sheet 1,2
ZOUT: U28.21(LAB:1-16) ; also sheet 2,3
Unconnected: CN7.6 CN7.7 CN7.8 SW2.1(A:NO) SW3.1(A:NO) SW4.1(A:NO) SW5.1(A:NO) U28.28(LAB:1-19) U28.30(LAB:1-21) U28.33(LAB:1-22) U28.34(LAB:1-23) U28.35(LAB:1-24) U28.36(LAB:1-25) U28.37(LAB:1-26) U28.38(LAB:1-27) U28.39(LAB:1-28) U28.40(LAB:1-29) U28.41(LAB:1-30) U28.42(LAB:1-31) U28.47(LAB:1-34) U28.48(LAB:1-35) U28.49(LAB:1-36) U28.50(LAB:1-37) U28.51(LAB:1-38) U28.62(LAB:2-9/CLK2) U28.64(LAB:2-10/CLK3) U28.66(LAB:2-11) U28.67(LAB:2-12) U28.68(LAB:2-13) U28.83(LAB:2-26) U28.84(LAB:2-27) U28.85(LAB:2-28) U28.86(LAB:2-29) U28.87(LAB:2-30) U28.88(LAB:2-31) U28.89(LAB:2-32) U28.90(LAB:2-33) U28.91(LAB:2-34) U28.92(LAB:2-35) U28.95(LAB:2-36) U28.96(LAB:2-37) U28.97(LAB:2-38) U28.98(LAB:2-39) U28.99(LAB:2-40) U28.100(LAB:2-41)

### Notes on the sheet
- O | O | O | O | O
- I | O
- I | I
- I | I
- I | I
- I | I
- O | I
- I | O
- O
- O
- O
- O
- I
- O
- O
- O | Downside
- Upside
- Downside
- Upside
- Downside
- SW_AMP_X10/!X1
- Upside
- Downside
- Upside
- EM-80D Marker coil driver
- SEQUENCER

## Sheet 5 of 5
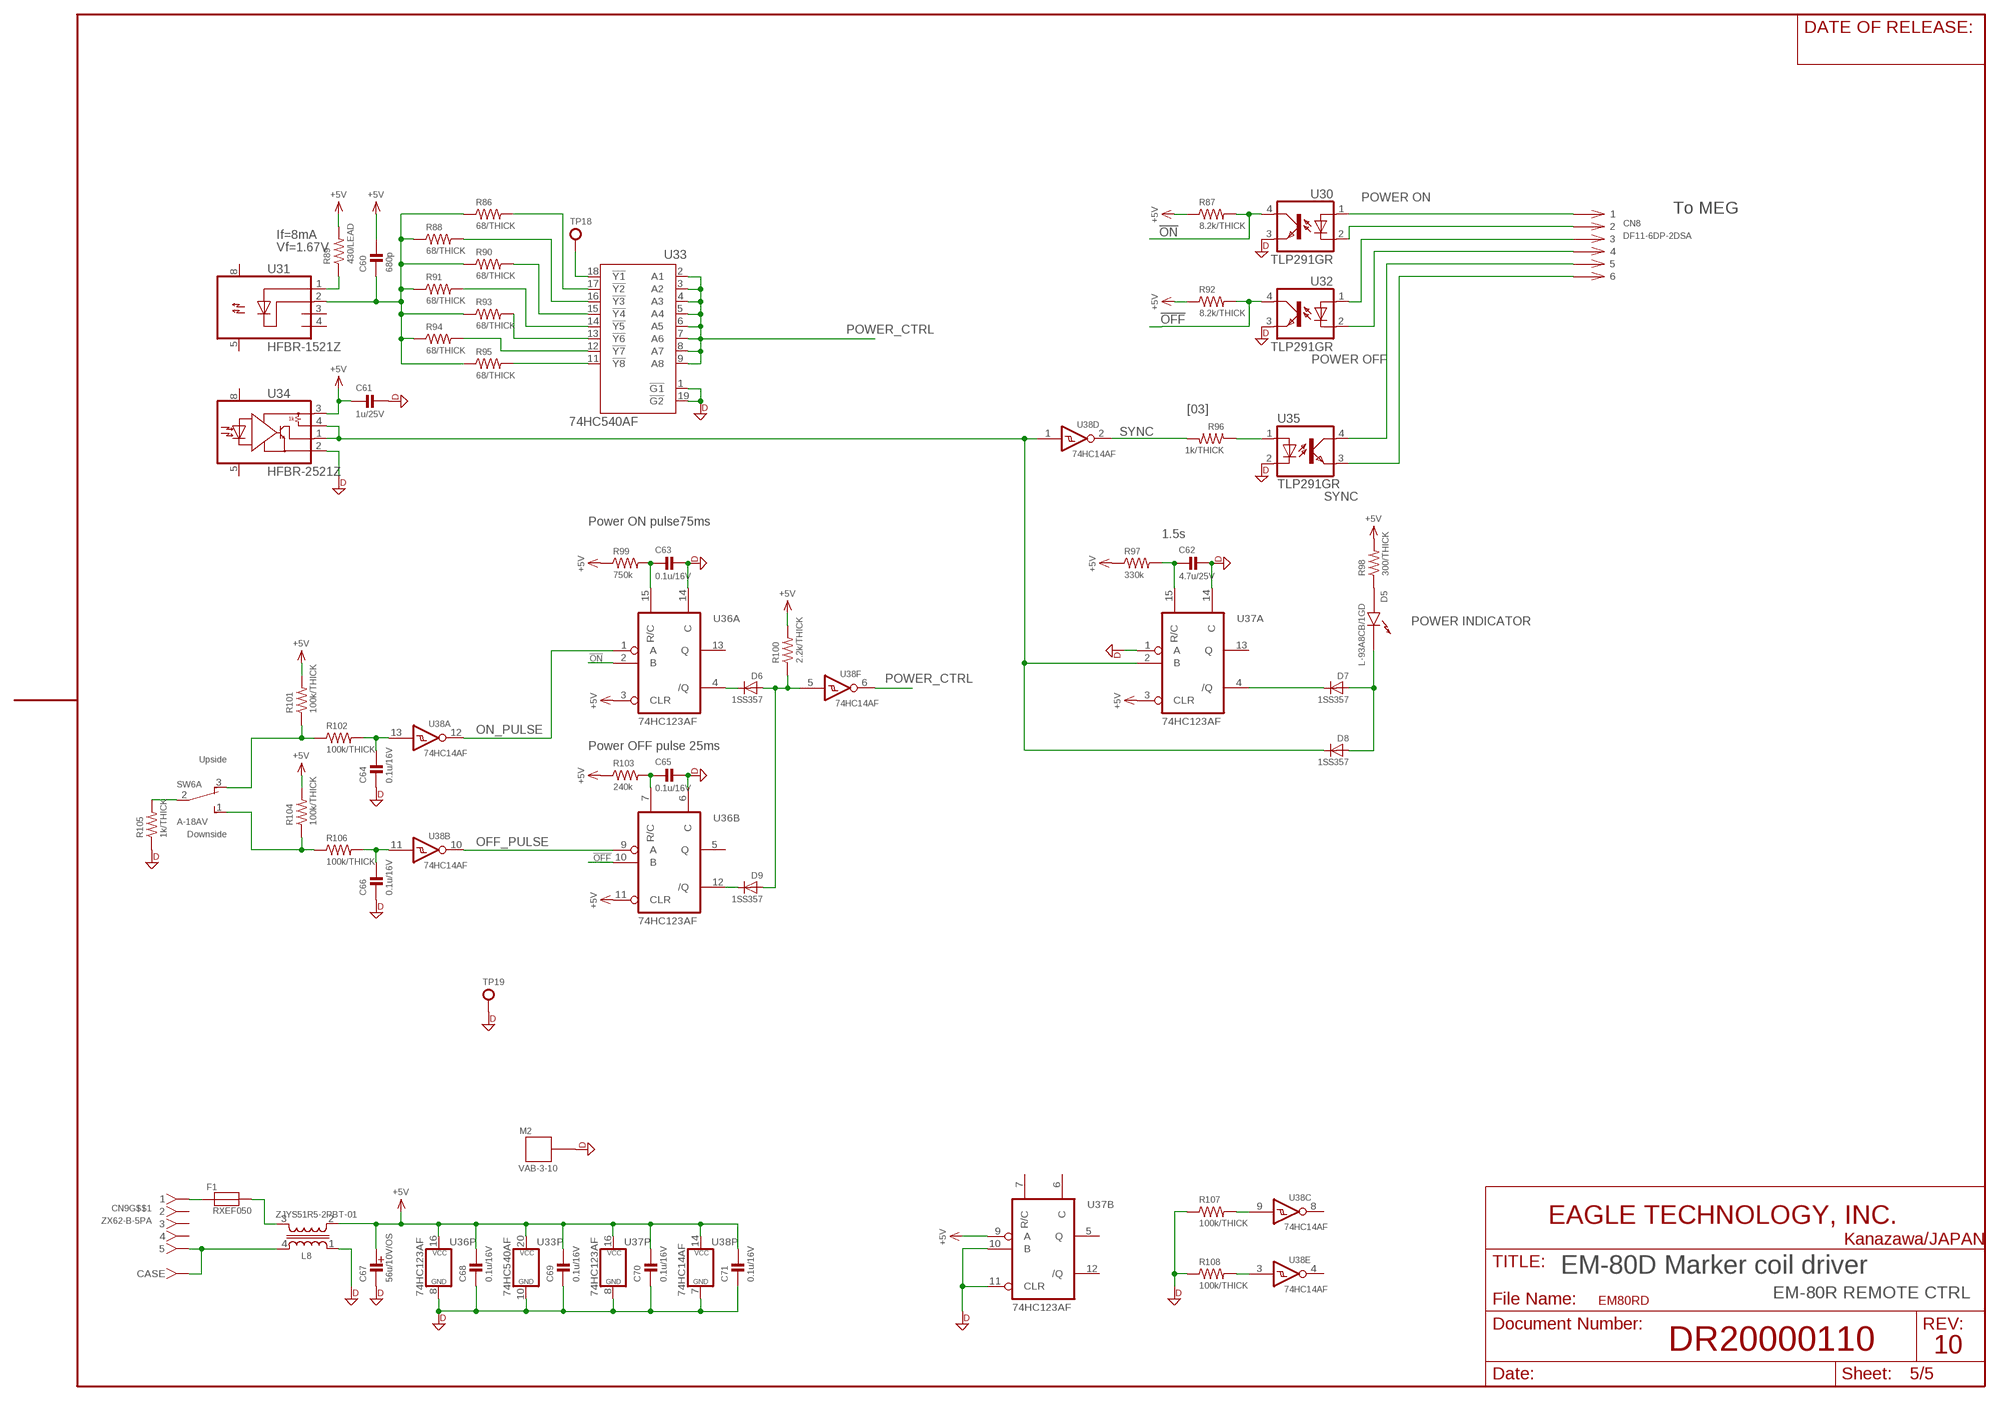
[diagram p5: schematic, sheet 5]

### Parts
C60  680p  CSMD1.6X0.8MM  [CM1608]
C61  1u/25V  CSMD2.0X1.2MM  [CM2012]
C62  4.7u/25V  CSMD2.0X1.2MM  [CM2012]
C63  0.1u/16V  CSMD2.0X1.2MM  [CM2012]
C64  0.1u/16V  CSMD1.6X0.8MM  [CM1608]
C65  0.1u/16V  CSMD2.0X1.2MM  [CM2012]
C66  0.1u/16V  CSMD1.6X0.8MM  [CM1608]
C67  56u/10V/OS  C_POL6.3-2.5MM  [PHI_6.3]
C68  0.1u/16V  CSMD1.6X0.8MM  [CM1608]
C69  0.1u/16V  CSMD1.6X0.8MM  [CM1608]
C70  0.1u/16V  CSMD1.6X0.8MM  [CM1608]
C71  0.1u/16V  CSMD1.6X0.8MM  [CM1608]
CN8  DF11-6DP-2DSA  [DF11-6DP-2DSA]
CN9  ZX62-B-5PA  [ZX62-B-5PA]
D5  L-93A8CB/1GD  [L-93A8CB]
D6  1SS357  [SOD323-R]
D7  1SS357  [SOD323-R]
D8  1SS357  [SOD323-R]
D9  1SS357  [SOD323-R]
F1  RXEF050  [8X3/5.08]
L8  ZJYS51R5-2PBT-01  ZJYS5R5-2PBT-01  [ZJYS51-2]
M2  VAB-3-10  [VAB_3_10_CONTACT]
R86  68/THICK  RSMD1.6X0.8MM  [RM1608]
R87  8.2k/THICK  RSMD1.6X0.8MM  [RM1608]
R88  68/THICK  RSMD1.6X0.8MM  [RM1608]
R89  430/LEAD  R0207/2V  [0207/2V]
R90  68/THICK  RSMD1.6X0.8MM  [RM1608]
R91  68/THICK  RSMD1.6X0.8MM  [RM1608]
R92  8.2k/THICK  RSMD1.6X0.8MM  [RM1608]
R93  68/THICK  RSMD1.6X0.8MM  [RM1608]
R94  68/THICK  RSMD1.6X0.8MM  [RM1608]
R95  68/THICK  RSMD1.6X0.8MM  [RM1608]
R96  1k/THICK  RSMD1.6X0.8MM  [RM1608]
R97  330k  RSMD1.6X0.8MM  [RM1608]
R98  300/THICK  RSMD1.6X0.8MM  [RM1608]
R99  750k  RSMD1.6X0.8MM  [RM1608]
R100  2.2k/THICK  RSMD1.6X0.8MM  [RM1608]
R101  100k/THICK  RSMD1.6X0.8MM  [RM1608]
R102  100k/THICK  RSMD1.6X0.8MM  [RM1608]
R103  240k  RSMD1.6X0.8MM  [RM1608]
R104  100k/THICK  RSMD1.6X0.8MM  [RM1608]
R105  1k/THICK  RSMD1.6X0.8MM  [RM1608]
R106  100k/THICK  RSMD1.6X0.8MM  [RM1608]
R107  100k/THICK  RSMD1.6X0.8MM  [RM1608]
R108  100k/THICK  RSMD1.6X0.8MM  [RM1608]
SW6  A-18AV  [A-12*]
TP18  TP-LC3G  [TP_TH_0R9MM]
TP19  TP-LC3G  [TP_TH_0R9MM]
U30  TLP291GR  [SO4(11-3C1)(TOSHIBA)]
U31  HFBR-1521Z  [HFBR-X52X]
U32  TLP291GR  [SO4(11-3C1)(TOSHIBA)]
U33  74HC540AF  74AC540AF  [SO20_300MIL]
U34  HFBR-2521Z  [HFBR-X52X]
U35  TLP291GR  [SO4(11-3C1)(TOSHIBA)]
U36  74HC123AF  [SO16_300MIL]
U37  74HC123AF  [SO16_300MIL]
U38  74HC14AF  [SO14_300MIL]

### Nets
!OFF: R92.2 U32.4(COL) U36.10(B:B)
!ON: R87.2 U30.4(COL) U36.2(A:B)
DGND: C61.1 C62.1 C63.1 C64.2 C65.1 C66.2 C67.NEG C68.2 C69.2 C70.2 C71.2 L8.1 M2.CASE1 R105.1 R107.1 R108.1 TP19.1(MP) U30.3(EMI) U32.3(EMI) U33.1(!G1) U33.10(GND) U33.19(!G2) U34.2(GND) U35.2(C) U36.6(B:C) U36.8(P:GND) U36.14(A:C) U37.1(A:A) U37.8(P:GND) U37.10(B:B) U37.11(B:CLR) U37.14(A:C) U38.7(P:GND) ; also sheet 1,2
N$55: C64.1 R102.2 U38.13(A:I)
N$61: R86.2 U33.17(!Y2)
N$63: R90.2 U33.15(!Y4)
N$65: R91.2 U33.14(!Y5)
N$66: R93.2 U33.13(!Y6)
N$67: R94.2 U33.12(!Y7)
N$68: R88.2 U33.16(!Y3)
N$69: TP18.1(MP) U33.18(!Y1)
N$70: C60.2 R86.1 R88.1 R90.1 R91.1 R93.1 R94.1 R95.1 U31.2(C)
N$73: C66.1 R106.2 U38.11(B:I)
N$77: R104.1 R106.1 SW6.1(A:NO)
N$92: R101.1 R102.1 SW6.3(A:NC)
N$94: R105.2 SW6.2(A:C)
N$95: D7.C U37.4(A:/Q)
N$97: R89.1 U31.1(A)
N$98: D8.C U34.1(VO) U34.4(RL) U37.2(A:B) U38.1(D:I)
N$100: CN9.1 F1.1
N$121: CN9.5 CN9.C1(CASE1) CN9.C2(CASE2) CN9.C3(CASE3) CN9.C4(CASE4) CN9.C5(CASE5) CN9.C6(CASE) L8.4
N$122: F1.2 L8.3
N$123: C62.2 R97.2 U37.15(A:R/C)
N$124: CN8.1 U30.1(A)
N$134: R96.1 U35.1(A)
N$143: CN8.2 U30.2(C)
N$146: CN8.3 U32.1(A)
N$147: CN8.4 U32.2(C)
N$148: CN8.5 U35.4(COL)
N$149: CN8.6 U35.3(EMI)
N$150: D5.A(A1) R98.1
N$151: D5.C(K1) D7.A D8.A
N$152: C65.2 R103.2 U36.7(B:R/C)
N$154: D6.C U36.4(A:/Q)
N$155: D9.C U36.12(B:/Q)
N$156: D6.A D9.A R100.1 U38.5(F:I)
N$163: C63.2 R99.2 U36.15(A:R/C)
N$186: R95.2 U33.11(!Y8)
N$199: R107.2 U38.9(C:I)
N$200: R108.2 U38.3(E:I)
OFF_PULSE: U36.9(B:A) U38.10(B:O)
ON_PULSE: U36.1(A:A) U38.12(A:O)
POWER_CTRL: U33.2(A1) U33.3(A2) U33.4(A3) U33.5(A4) U33.6(A5) U33.7(A6) U33.8(A7) U33.9(A8) U38.6(F:O)
SYNC: R96.2 U38.2(D:O)
V+5: C60.1 C61.2 C67.POS C68.1 C69.1 C70.1 C71.1 L8.2 R87.1 R89.2 R92.1 R97.1 R98.2 R99.1 R100.2 R101.2 R103.1 R104.2 U33.20(VCC) U34.3(VCC) U36.3(A:CLR) U36.11(B:CLR) U36.16(P:VCC) U37.3(A:CLR) U37.9(B:A) U37.16(P:VCC) U38.14(P:VCC)
Unconnected: CN9.2 CN9.3 CN9.4 SW6.7(HA:BRACKET) SW6.8(HB:BRACKET) U31.3(NC1) U31.4(NC2) U31.5(TAB2) U31.8(TAB1) U34.5(TAB2) U34.8(TAB1) U36.5(B:Q) U36.13(A:Q) U37.5(B:Q) U37.6(B:C) U37.7(B:R/C) U37.12(B:/Q) U37.13(A:Q) U38.4(E:O) U38.8(C:O)

### Notes on the sheet
- POWER ON
- To MEG
- If=8mA
- Vf=1.67V
- POWER OFF
- [03]
- SYNC
- Power ON pulse75ms
- 1.5s
- POWER INDICATOR
- Power OFF pulse 25ms
- Upside
- Downside
- EM-80D Marker coil driver
- EM-80R REMOTE CTRL

## Library data of the parts
C1-C6 C8-C27 C29 C31-C66 C68-C71 = AEL_RLC:C: CAPACITOR, European symbol
C7 C28 C30 C67 = AEL_RLC:C_POL: POL Cap Nihon-Chemicon Read components UVR1H100 10uF 5phi, 2.0mm pitch UVR1H470 47uF 6.3phi, 2.5mm pitch UVR1H101 100uF 8phi, 3.5mm pitch Panasonic SO package J16 : 17x17 - 17mm Height H13: 14x14 - 15mm Height
CN1-CN5 = AEL_terminal:35RAPC2BHN2: Switchcraft 3.5mm ST Jack without Switch contact
CN6 = AEL_terminal:DF11-4DP-2DS*
CN7 = AEL_terminal:PIN_HEADER_10PIN: 10 PIN HEADER(2x5), 2.54mm pitch 33mm x 5.3mm Akizuki Part No : C-00080 (40PIN) , @50JPY
CN8 = AEL_terminal:DF11-6DP-2DS*
CN9 = AEL_terminal:ZX62-B-5PA: Micro USB B connector HIROSE
D1 D2 D6-D9 = AEL_diode:1SS357: TOSHIBA SBD/ for switching 1SS357 Vf=0.6 @100mA VR=40V CT=18pF typ / 25pF max IR=100nA @10V, 25deg
D3 = AEL_diode:1SS*: Toshiba Diode TO236 Package 1:Anode1, 2:Casode2, 3:Anode2/Casode1; CT: 0.9pF; VF: 0.9V
D4 = AEL_LED:L-93A8CB: kingBright Angle type Indicator; COLOR: RED
D5 = AEL_LED:L-93A8CB: kingBright Angle type Indicator; COLOR: GREEN
F1 F2 = AEL_FUSE:RXEF050: Poly SW RXEF050 (500mA/72V) Thickness 3mm, Width 8mm, Lead Pitch 5.08(typ) Hight 14mm
L1-L8 = AEL_inductors:ZJYS5R5-2P: TDK Common mode choke coil ZJYS51R5-2 50V/2A max
M1 M2 = AEL_hole:VAB-3-10
R1-R39 R41-R50 R52-R108 = AEL_RLC:R: RESISTOR, American symbol
R40 R51 = AEL_RLC:R_POT
SW1-SW5 = AEL_SW:A-1*V: NKK PCB mount toggle sw PC-V type/single; FUNCTION: ON-ON; KNOB: normal
SW6 = AEL_SW:A-1*V: NKK PCB mount toggle sw PC-V type/single; FUNCTION: <ON>OFF<ON>; KNOB: normal
TP1-TP19 = AEL_terminal:TP-*: Testpoint
TR1 = AEL_TR-npn:2SC2712: TOSHIBA S-MINI NPN Transistor VCEO = 50 V IC = 150 mA max hFE = 70-700 O (O): 70~140, Y (Y): 120~240, GR (G): 200~400, BL (L): 350~700 Complementary to 2SA1162; HFE: 200-400
U1 U5 U7 U8 U30 U32 U35 = AEL_photocoupler:TLP291: Photo Coupler TLP291 TOSHIBA IC/IF = 50 to 400 Ioff=0.01mA ton, toff = 7us @ if=2mA Vdd max = 80V BVs=3750Vrms; IC-IF: 100-400
U2 = AEL_CMOS_LOG:TC7WZ14F: One Gate Logic IC TC7**14F TOSHIBA Vcc=1.8 to 5.5, 5V tolerant SZ : SHS, single gate WZ : SHS, multi gate/FF/decorder Vcc=1.8 to 3.6V, 3.6V tolerant SA : AHS, single gate PA : AHS, multi gate/FF/decorder
U3 U31 = AEL_photocoupler:HFBR-1521Z: AVAGO Optical fiber data link system HFBR-1521Z / DC-5Mbps Transmitter If = 60mA Vf = 1.67V
U4 U33 = AEL_CMOS_LOG:74*540
U6 U34 = AEL_photocoupler:HFBR-2521Z: AVAGO Optical fiber data link system HFBR-2521Z / DC-5Mbps Receiver Vcc=5V / Icc = 15mA
U9 = AEL_CMOS_LOG:74*74: Dual D type positive edge triggered FLIP FLOP, preset and clear
U10 U17 = AEL_linear:NJU7108: COMPARATOR JRC NJU7108 Low Power Voltage 1.0-5.5V/10uA Voff = 4mV Push-Pull output tp = 500ns/190ns
U11 U36 U37 = AEL_CMOS_LOG:74*123A
U12 = AEL_CMOS_LOG:TC7S00FU: One Gate Logic IC TC7S00F TOSHIBA Vcc=2 to 6
U13-U15 = AEL_linear:OPA2344: TI OP AMP OPA2344 Low Vcc RRIO GBW = 1MHz 0.8V/usec Voff = 1mVmax / 3uV/deg Vcc = 2.7 to 5.5 V / Icc0.15mA./amp
U16 = AEL_linear:TS5A23159: TI Analog SW / 2 x SPDT
U18 = AEL_CMOS_LOG:74*4052: STD C-MOS Analog MPX 2 x 4 to 1 74**4051 Avairable Technology: HC VHC
U19 = AEL_linear:TPS3808G: TI Supervisory Circuit TPS3808G01 : programmable voltage; VTH: Programmable
U20 U29 = AEL_linear:TPS799*: TI LDO TSOT23-5 package Iout = 200mAmax Vdrop = 100mV min Cout >= 2.0uF cer With ENABLE Function
U21 U22 = AEL_linear:MAX4617C: MAXIM Analog MPX 8 to 1 MAX4617C TSSOP16 0.65mm pitch
U23-U27 = AEL_modules:DR20000114: ReTHM OSC module
U28 = AEL_CMOS_LOG:5M160Z: ALTERA CPLD MAX V series 160LE
U38 = AEL_CMOS_LOG:74*14: Hex schmitt trigger INVERTER